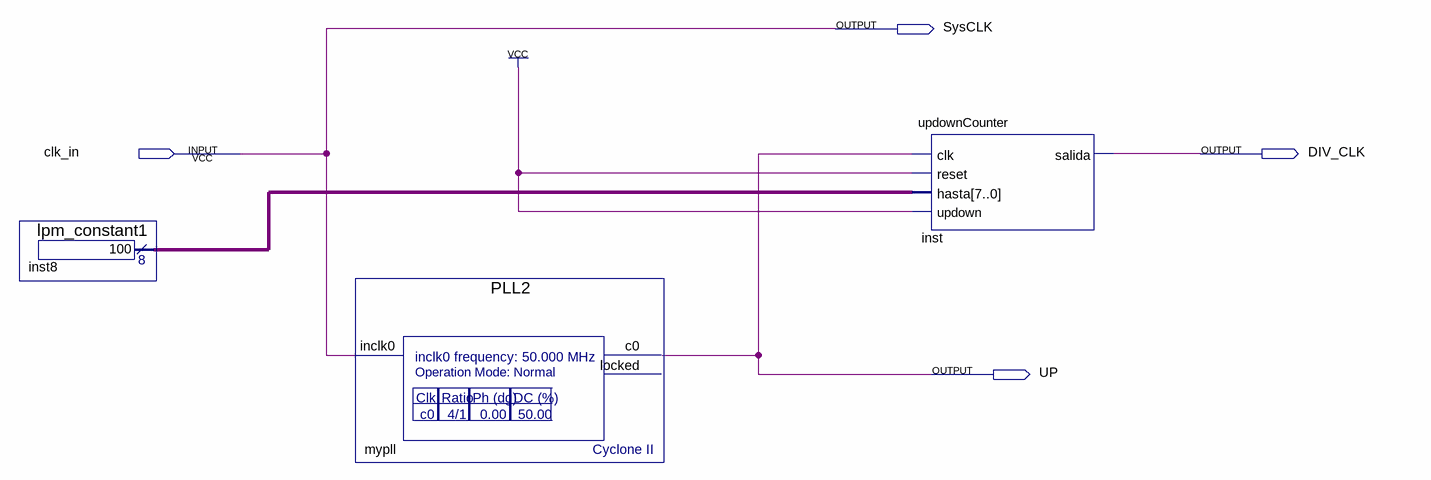
[diagram p0: schematic sheet]
// Quartus schematic PLLearn.bdf as structural Verilog: 3 symbols, 4 pins
module PLLearn (
  input  clk_in,
  output SysCLK,
  output DIV_CLK,
  output UP
);

  wire [7:0] inst8_result;

  lpm_constant1 inst8 (.result(inst8_result));
  PLL2 mypll (.inclk0(clk_in), .c0(UP));  // open: locked
  updownCounter inst (.clk(UP), .reset(1'b1), .hasta(inst8_result), .updown(1'b1), .salida(DIV_CLK));

  assign SysCLK = clk_in;
endmodule
